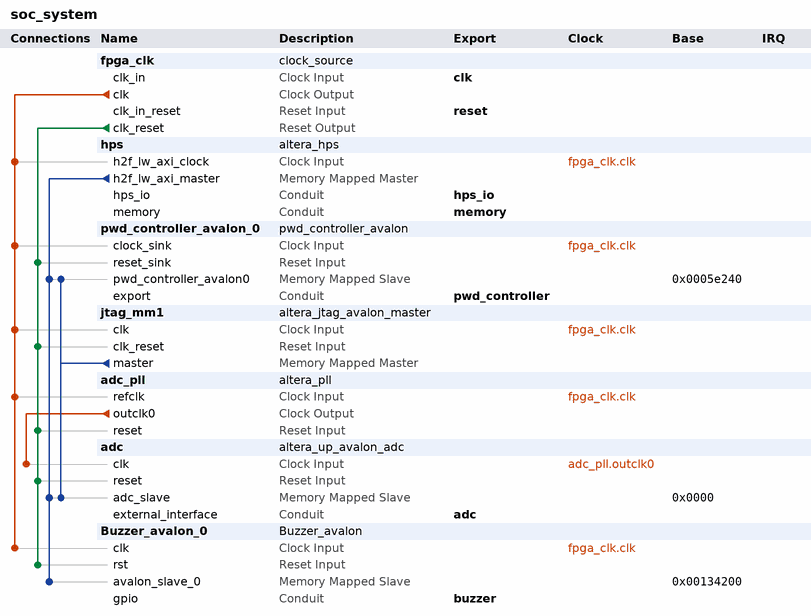
[diagram p0: system contents]
# Platform Designer (Qsys) system soc_system, Cyclone V 5CSEBA6U23I7
# Parameters at their usual value, and those the tool derives, are not listed.
package require -exact qsys 23.1
create_system soc_system
set_project_property DEVICE_FAMILY {Cyclone V}
set_project_property DEVICE 5CSEBA6U23I7

add_instance fpga_clk clock_source 23.1
set_instance_parameter_value fpga_clk clockFrequency 50000000
set_instance_parameter_value fpga_clk resetSynchronousEdges DEASSERT

add_instance hps altera_hps 23.1
set_instance_parameter_value hps EMAC1_Mode RGMII
set_instance_parameter_value hps EMAC1_PinMuxing {HPS I/O Set 0}
set_instance_parameter_value hps F2SCLK_COLDRST_Enable false
set_instance_parameter_value hps F2SCLK_DBGRST_Enable false
set_instance_parameter_value hps F2SCLK_WARMRST_Enable false
set_instance_parameter_value hps F2SINTERRUPT_Enable false
set_instance_parameter_value hps F2S_Width 0
set_instance_parameter_value hps FPGA_PERIPHERAL_OUTPUT_CLOCK_FREQ_EMAC0_GTX_CLK 100
set_instance_parameter_value hps FPGA_PERIPHERAL_OUTPUT_CLOCK_FREQ_EMAC0_MD_CLK 100.0
set_instance_parameter_value hps FPGA_PERIPHERAL_OUTPUT_CLOCK_FREQ_EMAC1_GTX_CLK 100
set_instance_parameter_value hps FPGA_PERIPHERAL_OUTPUT_CLOCK_FREQ_EMAC1_MD_CLK 100.0
set_instance_parameter_value hps HPS_PROTOCOL DDR3
set_instance_parameter_value hps I2C0_Mode I2C
set_instance_parameter_value hps I2C0_PinMuxing {HPS I/O Set 0}
set_instance_parameter_value hps I2C1_Mode I2C
set_instance_parameter_value hps I2C1_PinMuxing {HPS I/O Set 0}
set_instance_parameter_value hps LWH2F_Enable true
set_instance_parameter_value hps MEM_BANKADDR_WIDTH 3
set_instance_parameter_value hps MEM_CLK_FREQ 400.0
set_instance_parameter_value hps MEM_COL_ADDR_WIDTH 10
set_instance_parameter_value hps MEM_DQ_WIDTH 32
set_instance_parameter_value hps MEM_DRV_STR RZQ/6
set_instance_parameter_value hps MEM_ROW_ADDR_WIDTH 15
set_instance_parameter_value hps MEM_RTT_NOM RZQ/6
set_instance_parameter_value hps MEM_RTT_WR {Dynamic ODT off}
set_instance_parameter_value hps MEM_TCL 7
set_instance_parameter_value hps MEM_TFAW_NS 37.5
set_instance_parameter_value hps MEM_TRAS_NS 35.0
set_instance_parameter_value hps MEM_TRCD_NS 13.75
set_instance_parameter_value hps MEM_TRFC_NS 300.0
set_instance_parameter_value hps MEM_TRP_NS 13.75
set_instance_parameter_value hps MEM_VENDOR Other
set_instance_parameter_value hps MEM_WTCL 7
set_instance_parameter_value hps QSPI_Mode N/A
set_instance_parameter_value hps QSPI_PinMuxing Unused
set_instance_parameter_value hps REF_CLK_FREQ 25.0
set_instance_parameter_value hps S2FCLK_USER2CLK 4
set_instance_parameter_value hps S2F_Width 0
set_instance_parameter_value hps SDIO_Mode {4-bit Data}
set_instance_parameter_value hps SDIO_PinMuxing {HPS I/O Set 0}
set_instance_parameter_value hps SPIM1_Mode {Single Slave Select}
set_instance_parameter_value hps SPIM1_PinMuxing {HPS I/O Set 0}
set_instance_parameter_value hps STM_Enable false
set_instance_parameter_value hps TIMING_BOARD_AC_SKEW 0.02
set_instance_parameter_value hps TIMING_BOARD_AC_TO_CK_SKEW 0.0
set_instance_parameter_value hps TIMING_BOARD_DQ_TO_DQS_SKEW 0.0
set_instance_parameter_value hps TIMING_BOARD_MAX_CK_DELAY 0.6
set_instance_parameter_value hps TIMING_BOARD_MAX_DQS_DELAY 0.6
set_instance_parameter_value hps TIMING_BOARD_SKEW_BETWEEN_DQS 0.02
set_instance_parameter_value hps TIMING_BOARD_SKEW_CKDQS_DIMM_MAX 0.01
set_instance_parameter_value hps TIMING_BOARD_SKEW_CKDQS_DIMM_MIN -0.01
set_instance_parameter_value hps TIMING_BOARD_SKEW_WITHIN_DQS 0.02
set_instance_parameter_value hps TIMING_TDH 125
set_instance_parameter_value hps TIMING_TDQSCK 400
set_instance_parameter_value hps TIMING_TDQSQ 120
set_instance_parameter_value hps TIMING_TDS 50
set_instance_parameter_value hps TIMING_TIH 250
set_instance_parameter_value hps TIMING_TIS 175
set_instance_parameter_value hps TIMING_TQSH 0.38
set_instance_parameter_value hps UART0_Mode {No Flow Control}
set_instance_parameter_value hps UART0_PinMuxing {HPS I/O Set 0}
set_instance_parameter_value hps USB1_Mode SDR
set_instance_parameter_value hps USB1_PinMuxing {HPS I/O Set 0}
set_instance_parameter_value hps desired_cfg_clk_mhz 100.0
set_instance_parameter_value hps desired_mpu_clk_mhz 0.0
set_instance_parameter_value hps desired_qspi_clk_mhz 370.0

add_instance pwd_controller_avalon_0 pwd_controller_avalon 1.0

add_instance jtag_mm1 altera_jtag_avalon_master 23.1

add_instance adc_pll altera_pll 23.1
set_instance_parameter_value adc_pll gui_device_speed_grade 1
set_instance_parameter_value adc_pll gui_number_of_clocks 1
set_instance_parameter_value adc_pll gui_operation_mode direct
set_instance_parameter_value adc_pll gui_output_clock_frequency0 12.5
set_instance_parameter_value adc_pll gui_pll_mode {Integer-N PLL}
set_instance_parameter_value adc_pll gui_reference_clock_frequency 50.0
set_instance_parameter_value adc_pll gui_use_locked false

add_instance adc altera_up_avalon_adc 18.0
set_instance_parameter_value adc board DE10-Nano
set_instance_parameter_value adc numch_ 8

add_instance Buzzer_avalon_0 Buzzer_avalon 1.0

# connections
add_connection adc_pll.outclk0 adc.clk clock
add_connection fpga_clk.clk adc_pll.refclk clock
add_connection fpga_clk.clk Buzzer_avalon_0.clk clock
add_connection fpga_clk.clk hps.h2f_lw_axi_clock clock
add_connection fpga_clk.clk jtag_mm1.clk clock
add_connection fpga_clk.clk pwd_controller_avalon_0.clock_sink clock
add_connection fpga_clk.clk_reset adc.reset reset
add_connection fpga_clk.clk_reset adc_pll.reset reset
add_connection fpga_clk.clk_reset Buzzer_avalon_0.rst reset
add_connection fpga_clk.clk_reset jtag_mm1.clk_reset reset
add_connection fpga_clk.clk_reset pwd_controller_avalon_0.reset_sink reset
add_connection hps.h2f_lw_axi_master adc.adc_slave avalon
set_connection_parameter_value hps.h2f_lw_axi_master/adc.adc_slave baseAddress 0x0000
add_connection hps.h2f_lw_axi_master Buzzer_avalon_0.avalon_slave_0 avalon
set_connection_parameter_value hps.h2f_lw_axi_master/Buzzer_avalon_0.avalon_slave_0 baseAddress 0x00134200
add_connection hps.h2f_lw_axi_master pwd_controller_avalon_0.pwd_controller_avalon0 avalon
set_connection_parameter_value hps.h2f_lw_axi_master/pwd_controller_avalon_0.pwd_controller_avalon0 baseAddress 0x0005e240
add_connection jtag_mm1.master adc.adc_slave avalon
set_connection_parameter_value jtag_mm1.master/adc.adc_slave baseAddress 0x0000
add_connection jtag_mm1.master pwd_controller_avalon_0.pwd_controller_avalon0 avalon
set_connection_parameter_value jtag_mm1.master/pwd_controller_avalon_0.pwd_controller_avalon0 baseAddress 0x0005e240

# exported interfaces
add_interface adc conduit end
set_interface_property adc EXPORT_OF adc.external_interface
add_interface buzzer conduit end
set_interface_property buzzer EXPORT_OF Buzzer_avalon_0.gpio
add_interface clk clock sink
set_interface_property clk EXPORT_OF fpga_clk.clk_in
add_interface hps_io conduit end
set_interface_property hps_io EXPORT_OF hps.hps_io
add_interface memory conduit end
set_interface_property memory EXPORT_OF hps.memory
add_interface pwd_controller conduit end
set_interface_property pwd_controller EXPORT_OF pwd_controller_avalon_0.export
add_interface reset reset sink
set_interface_property reset EXPORT_OF fpga_clk.clk_in_reset

set_interconnect_requirement {$system} qsys_mm.clockCrossingAdapter HANDSHAKE
set_interconnect_requirement {$system} qsys_mm.maxAdditionalLatency 1

save_system soc_system.qsys
